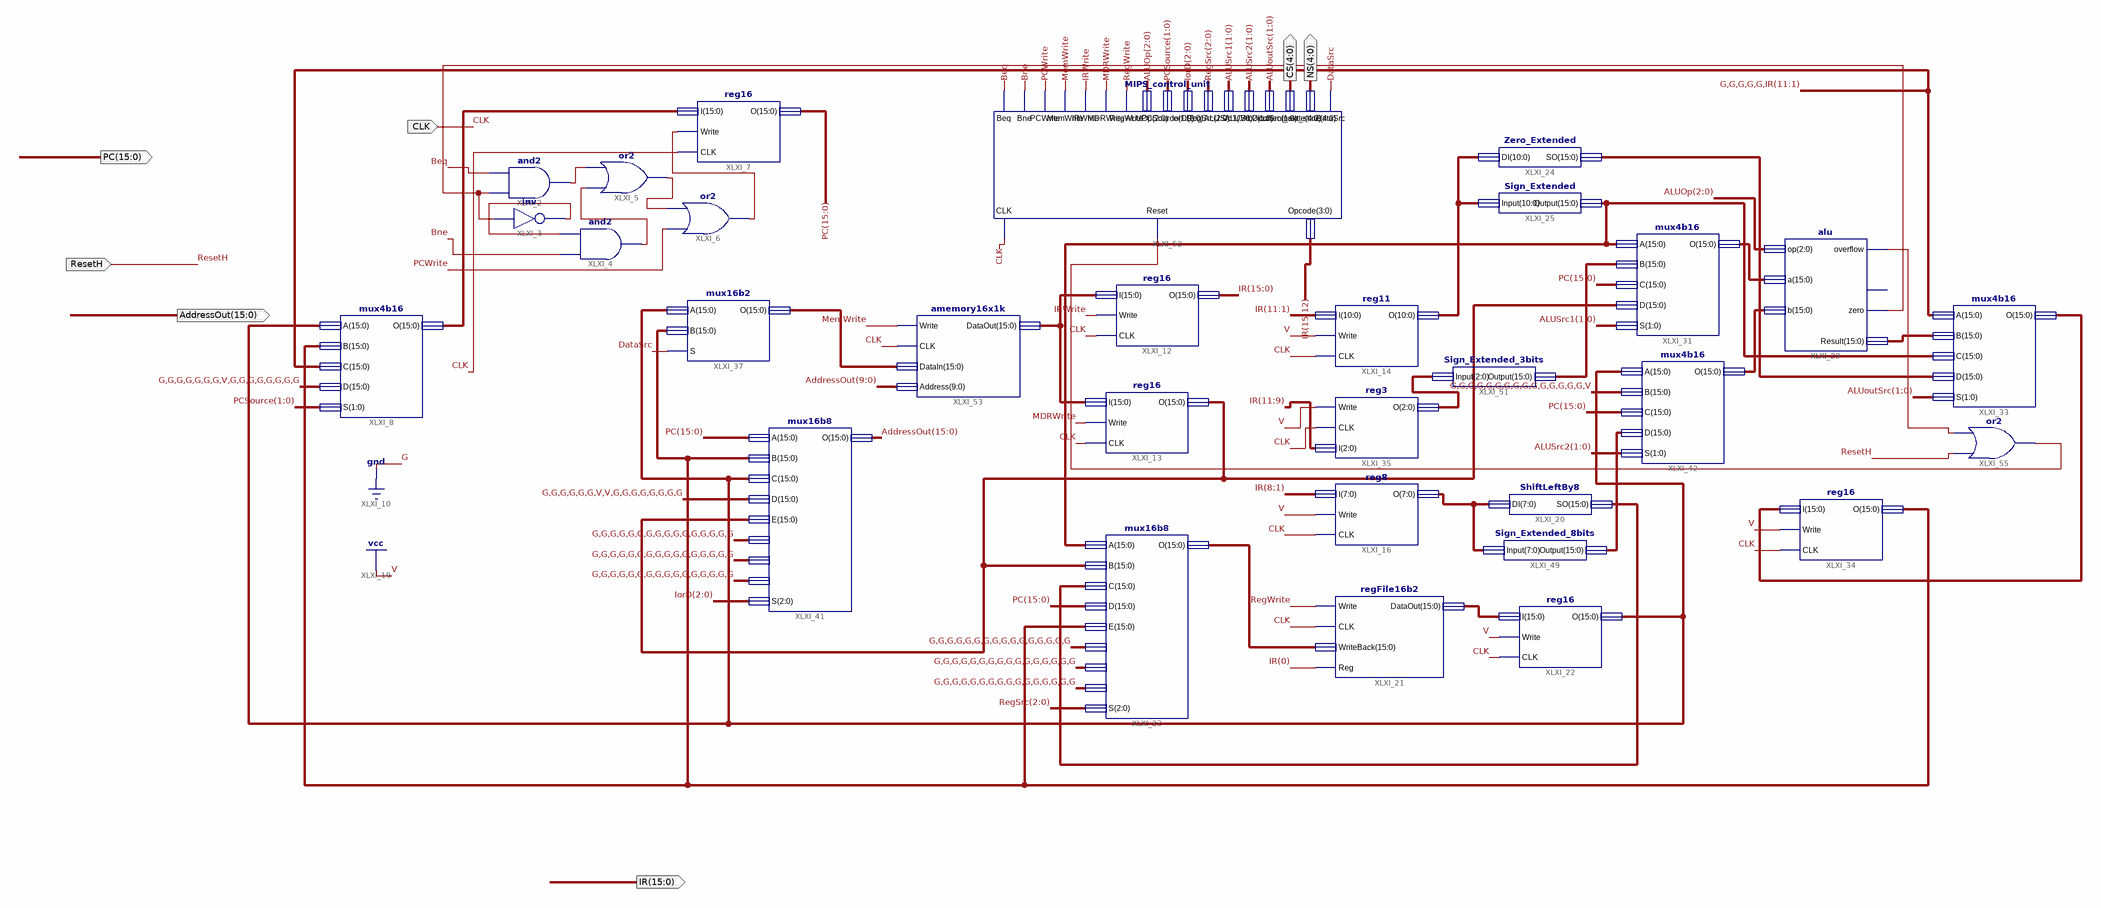
[diagram p0: schematic sheet 1]
// Xilinx ISE schematic DataPath.sch (spartan3e) as structural Verilog: 30 symbols, 7 ports
module DataPath (
  input  CLK,
  input  ResetH,
  output [15:0] PC,
  output [15:0] IR,
  output [4:0] CS,
  output [15:0] AddressOut,
  output [4:0] NS
);

  wire Beq, Bne, DataSrc, G, IRWrite, MDRWrite, MemWrite, PCWrite, RegWrite, XLXN_3, XLXN_5, XLXN_6, XLXN_9,
       XLXN_11, XLXN_99, XLXN_189, XLXN_191;
  wire [1:0] ALUoutSrc, ALUSrc1, ALUSrc2, PCSource;
  wire [2:0] ALUOp, IorD, RegSrc, XLXN_173;
  wire [7:0] O;
  wire [10:0] XLXN_81;
  wire [15:0] XLXN_15, XLXN_36, XLXN_37, XLXN_76, XLXN_79, XLXN_84, XLXN_85, XLXN_89, XLXN_94, XLXN_95,
       XLXN_101, XLXN_102, XLXN_109, XLXN_146, XLXN_159, XLXN_168, XLXN_174;

  and XLXI_2 (XLXN_5, XLXN_99, Beq);
  not XLXI_3 (XLXN_3, XLXN_99);
  and XLXI_4 (XLXN_6, Bne, XLXN_3);
  or XLXI_5 (XLXN_9, XLXN_6, XLXN_5);
  or XLXI_6 (XLXN_11, PCWrite, XLXN_9);
  reg16 XLXI_7 (.I(XLXN_15), .Write(XLXN_11), .CLK(CLK), .O(PC));
  mux4b16 XLXI_8 (
    .A(XLXN_37), .B(XLXN_36), .C({{5{G}}, IR[11:1]}), .D({{7{G}}, 1'b1, {8{G}}}), .S(PCSource), .O(XLXN_15));
  reg16 XLXI_12 (.I(XLXN_168), .Write(IRWrite), .CLK(CLK), .O(IR));
  reg16 XLXI_13 (.I(XLXN_168), .Write(MDRWrite), .CLK(CLK), .O(XLXN_89));
  reg11 XLXI_14 (.I(IR[11:1]), .Write(1'b1), .CLK(CLK), .O(XLXN_81));
  reg8 XLXI_16 (.I(IR[8:1]), .Write(1'b1), .CLK(CLK), .O(O));
  ShiftLeftBy8 XLXI_20 (.DI(O), .SO(XLXN_109));
  regFile16b2 XLXI_21 (.Write(RegWrite), .CLK(CLK), .WriteBack(XLXN_76), .Reg(IR[0]), .DataOut(XLXN_79));
  reg16 XLXI_22 (.I(XLXN_79), .Write(1'b1), .CLK(CLK), .O(XLXN_37));
  mux16b8 XLXI_23 (
    .A(XLXN_85), .B(XLXN_89), .C(XLXN_109), .D(PC), .E(XLXN_36), .F({16{G}}), .G({16{G}}), .H({16{G}}),
    .S(RegSrc), .O(XLXN_76));
  Zero_Extended XLXI_24 (.DI(XLXN_81), .SO(XLXN_84));
  Sign_Extended XLXI_25 (.Input(XLXN_81), .Output(XLXN_85));
  alu XLXI_29 (
    .op(ALUOp), .a(XLXN_94), .b(XLXN_95), .overflow(XLXN_189), .zero(XLXN_99), .Result(XLXN_101));  // open: co
  mux4b16 XLXI_31 (.A(XLXN_85), .B(XLXN_174), .C(PC), .D(XLXN_89), .S(ALUSrc1), .O(XLXN_94));
  mux4b16 XLXI_33 (.A({{5{G}}, IR[11:1]}), .B(XLXN_101), .C(XLXN_85), .D(XLXN_84), .S(ALUoutSrc), .O(XLXN_102));
  reg16 XLXI_34 (.I(XLXN_102), .Write(1'b1), .CLK(CLK), .O(XLXN_36));
  reg3 XLXI_35 (.Write(1'b1), .CLK(CLK), .I(IR[11:9]), .O(XLXN_173));
  mux16b2 XLXI_37 (.A(XLXN_37), .B(XLXN_36), .S(DataSrc), .O(XLXN_146));
  mux16b8 XLXI_41 (
    .A(PC), .B(XLXN_36), .C(XLXN_37), .D({{6{G}}, 2'b11, {8{G}}}), .E(XLXN_89), .F({16{G}}), .G({16{G}}),
    .H({16{G}}), .S(IorD), .O(AddressOut));
  mux4b16 XLXI_42 (.A(XLXN_37), .B({{15{G}}, 1'b1}), .C(PC), .D(XLXN_159), .S(ALUSrc2), .O(XLXN_95));
  Sign_Extended_8bits XLXI_49 (.Input(O), .Output(XLXN_159));
  Sign_Extended_3bits XLXI_51 (.Input(XLXN_173), .Output(XLXN_174));
  MIPS_control_unit XLXI_52 (
    .CLK(CLK), .Reset(XLXN_191), .Opcode(IR[15:12]), .Beq(Beq), .Bne(Bne), .PCWrite(PCWrite),
    .MemWrite(MemWrite), .IRWrite(IRWrite), .MDRWrite(MDRWrite), .RegWrite(RegWrite), .DataSrc(DataSrc),
    .ALUOp(ALUOp), .PCSource(PCSource), .IorD(IorD), .RegSrc(RegSrc), .ALUSrc1(ALUSrc1), .ALUSrc2(ALUSrc2),
    .ALUoutSrc(ALUoutSrc), .current_state(CS), .next_state(NS));
  amemory16x1k XLXI_53 (.Write(MemWrite), .CLK(CLK), .DataIn(XLXN_146), .Address(AddressOut[9:0]), .DataOut(XLXN_168));
  or XLXI_55 (XLXN_191, ResetH, XLXN_189);
  // also tied to GND on the sheet: G
endmodule
